# Altium schematic sheet modulo_temperaturaUmidade.SchDoc
size A4; SheetNumber: 1; SheetTotal: 1
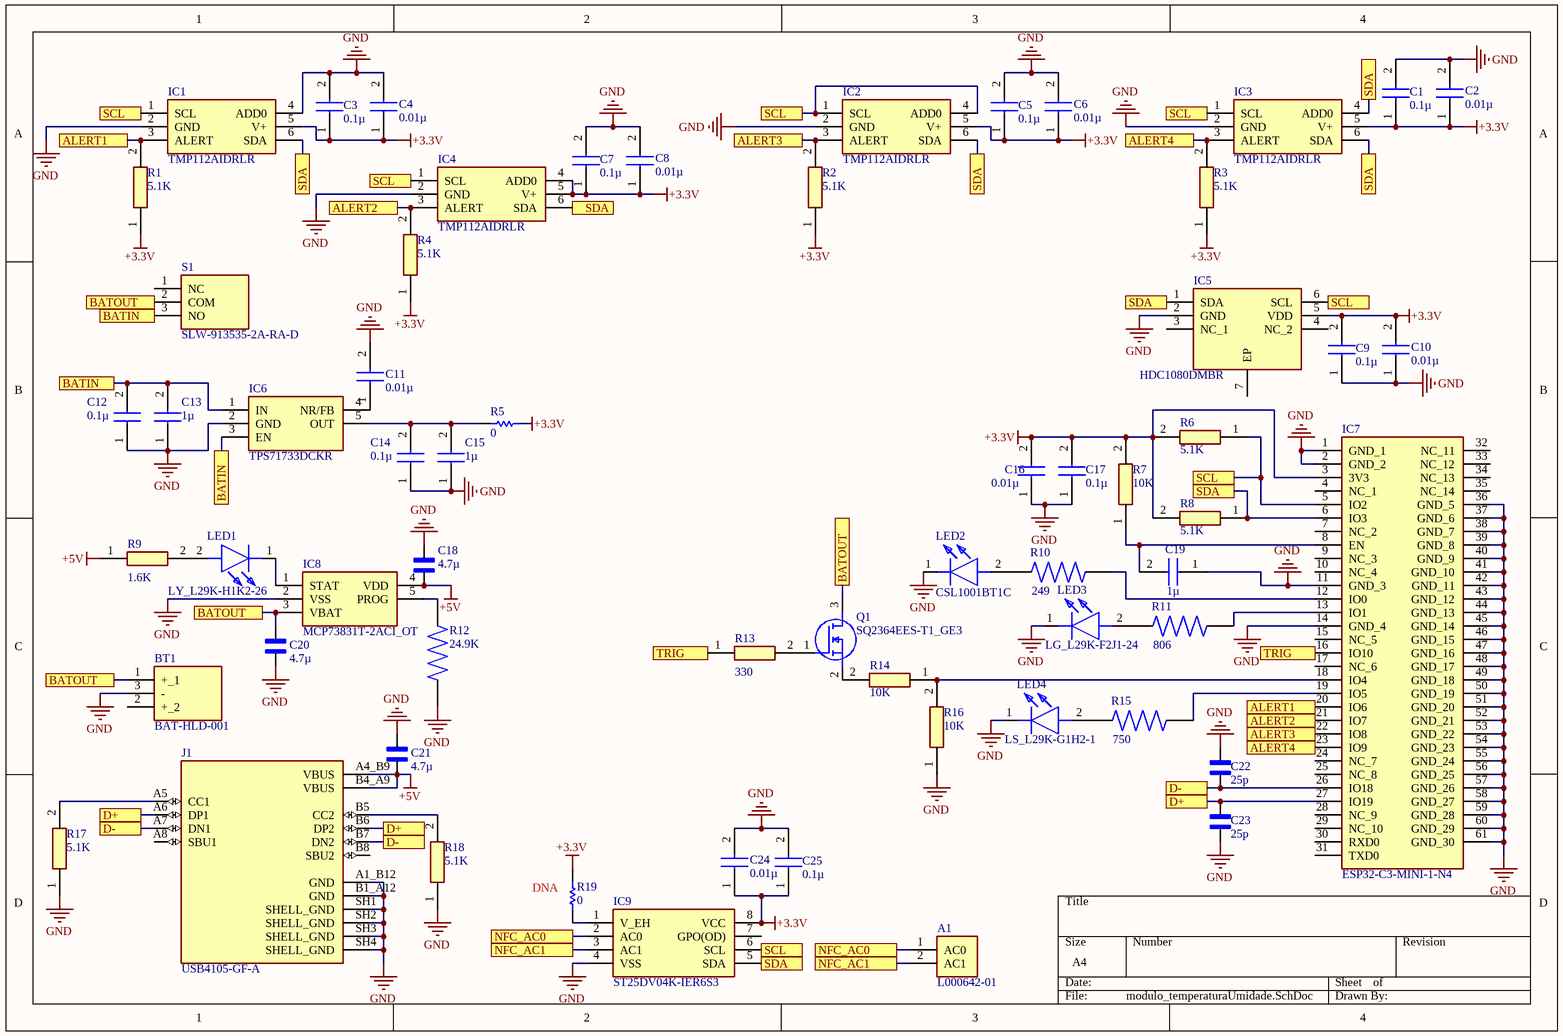
[diagram p0: modulo_temperaturaUmidade.SchDoc]

## Parts
A1  L000642-01
BT1  BAT-HLD-001  [BATHLD001]
C1  value 0.1µ  [C0603]  (hidden comment: C0603C104K4RACTU)
C2  value 0.01µ  [C0603]  (hidden comment: C0603C103K4RECTU)
C3  value 0.1µ  [C0603]  (hidden comment: C0603C104K4RACTU)
C4  value 0.01µ  [C0603]  (hidden comment: C0603C103K4RECTU)
C5  value 0.1µ  [C0603]  (hidden comment: C0603C104K4RACTU)
C6  value 0.01µ  [C0603]  (hidden comment: C0603C103K4RECTU)
C7  value 0.1µ  [C0603]  (hidden comment: C0603C104K4RACTU)
C8  value 0.01µ  [C0603]  (hidden comment: C0603C103K4RECTU)
C9  value 0.1µ  [C0603]  (hidden comment: C0603C104K4RACTU)
C10  value 0.01µ  [C0603]  (hidden comment: C0603C103K4RECTU)
C11  value 0.01µ  [C0603]  (hidden comment: C0603C103K4RECTU)
C12  value 0.1µ  [C0603]  (hidden comment: C0603C104K4RACTU)
C13  value 1µ  [CAPC1608X90N]  (hidden comment: CL10B105KO8NNNC)
C14  value 0.1µ  [C0603]  (hidden comment: C0603C104K4RACTU)
C15  value 1µ  [CAPC1608X90N]  (hidden comment: CL10B105KO8NNNC)
C16  value 0.01µ  [C0603]  (hidden comment: C0603C103K4RECTU)
C17  value 0.1µ  [C0603]  (hidden comment: C0603C104K4RACTU)
C18  value 4.7µ  [CAPC2012X140N]  (hidden comment: GRM21BR71C475KE51L)
C19  value 1µ  [CAPC1608X90N]  (hidden comment: CL10B105KO8NNNC)
C20  value 4.7µ  [CAPC2012X140N]  (hidden comment: GRM21BR71C475KE51L)
C21  value 4.7µ  [CAPC2012X140N]  (hidden comment: GRM21BR71C475KE51L)
C22  value 25p  [CAPC1608X90]  (hidden comment: CC0603JRNPO9BN250)
C23  value 25p  [CAPC1608X90]  (hidden comment: CC0603JRNPO9BN250)
C24  value 0.01µ  [C0603]  (hidden comment: C0603C103K4RECTU)
C25  value 0.1µ  [C0603]  (hidden comment: C0603C104K4RACTU)
IC1  TMP112AIDRLR  [SOTFL50P160X60-6N]
IC2  TMP112AIDRLR  [SOTFL50P160X60-6N]
IC3  TMP112AIDRLR  [SOTFL50P160X60-6N]
IC4  TMP112AIDRLR  [SOTFL50P160X60-6N]
IC5  HDC1080DMBR  [SON100P300X300X80-7N-D]
IC6  TPS71733DCKR  [SOT65P210X110-5N]
IC7  ESP32-C3-MINI-1-N4  [ESP32C3MINI1N4]
IC8  MCP73831T-2ACI_OT  [SOT95P270X145-5N]
IC9  ST25DV04K-IER6S3  [SOIC127P600X175-8N]
J1  USB4105-GF-A  [GCT_USB4105-GF-A]
LED1  LY_L29K-H1K2-26  [LYL29KH1K226]
LED2  CSL1001BT1C  [CSL1001BT1C]
LED3  LG_L29K-F2J1-24  [LEDC1308X67N]
LED4  LS_L29K-G1H2-1  [LEDC1308X67N]
Q1  SQ2364EES-T1_GE3  [SOT95P237X112-3N]
R1  value 5.1K  [RESC1608X60N]  (hidden comment: RR0816P-512-D)
R2  value 5.1K  [RESC1608X60N]  (hidden comment: RR0816P-512-D)
R3  value 5.1K  [RESC1608X60N]  (hidden comment: RR0816P-512-D)
R4  value 5.1K  [RESC1608X60N]  (hidden comment: RR0816P-512-D)
R5  value 0  (hidden comment: Resistor)
R6  value 5.1K  [RESC1608X60N]  (hidden comment: RR0816P-512-D)
R7  value 10K  [RESC1608X60N]  (hidden comment: RR0816P-103-D)
R8  value 5.1K  [RESC1608X60N]  (hidden comment: RR0816P-512-D)
R9  value 1.6K  [RESC1608X50N]  (hidden comment: RR0816P-162-D)
R10  value 249  [RESC1608X50N]  (hidden comment: RR0816P-2490-D-39A)
R11  value 806  [RESC1608X50N]  (hidden comment: RR0816P-8060-D-88A)
R12  value 24.9K  [RESC1608X50N]  (hidden comment: RR0816P-2492-D-39C)
R13  value 330  [RESC1608X60N]  (hidden comment: RR0816P-331-D)
R14  value 10K  [RESC1608X60N]  (hidden comment: RR0816P-103-D)
R15  value 750  [RESC1608X50N]  (hidden comment: RR0816P-751-D)
R16  value 10K  [RESC1608X60N]  (hidden comment: RR0816P-103-D)
R17  value 5.1K  [RESC1608X60N]  (hidden comment: RR0816P-512-D)
R18  value 5.1K  [RESC1608X60N]  (hidden comment: RR0816P-512-D)
R19  value 0  (hidden comment: Resistor)
S1  SLW-913535-2A-RA-D  [SLW9135352ARAD]

## Ports
ALERT1, ALERT2, ALERT3, ALERT4, BATIN, BATOUT, D+, D-, NFC_AC0, NFC_AC1, SCL, SDA, TRIG

## Nets
+3.3V: C1.1 C2.1 C3.1 C4.1 C5.1 C6.1 C7.1 C8.1 C9.2 C10.2 C16.2 C17.2 C24.1 C25.1 IC1.5(V+) IC2.5(V+) IC3.5(V+) IC4.4(ADD0) IC4.5(V+) IC5.5(VDD) IC7.3(3V3) IC9.8(VCC) R1.1(R1) R2.1(R1) R3.1(R1) R4.1(R1) R5.2 R6.2(R2) R7.2(R2) R8.2(R2) R19.1
+5V: C18.1 C21.1 IC8.4(VDD) J1.A4_B9(VBUS) J1.B4_A9(VBUS) R9.1
GND: BT1.3(-) C1.2 C2.2 C3.2 C4.2 C5.2 C6.2 C7.2 C8.2 C9.1 C10.1 C11.2 C12.1 C13.1 C14.1 C15.1 C16.1 C17.1 C18.2 C19.1 C20.1 C21.2 C22.1 C23.2 C24.2 C25.2 IC1.2(GND) IC1.4(ADD0) IC2.2(GND) IC3.2(GND) IC4.2(GND) IC5.2(GND) IC6.2(GND) IC7.1(GND_1) IC7.2(GND_2) IC7.11(GND_3) IC7.14(GND_4) IC7.36(GND_5) IC7.37(GND_6) IC7.38(GND_7) IC7.39(GND_8) IC7.40(GND_9) IC7.41(GND_10) IC7.42(GND_11) IC7.43(GND_12) IC7.44(GND_13) IC7.45(GND_14) IC7.46(GND_15) IC7.47(GND_16) IC7.48(GND_17) IC7.49(GND_18) IC7.50(GND_19) IC7.51(GND_20) IC7.52(GND_21) IC7.53(GND_22) IC7.54(GND_23) IC7.55(GND_24) IC7.56(GND_25) IC7.57(GND_26) IC7.58(GND_27) IC7.59(GND_28) IC7.60(GND_29) IC7.61(GND_30) IC8.2(VSS) IC9.4(VSS) J1.A1_B12(GND) J1.B1_A12(GND) J1.SH1(SHELL_GND) J1.SH2(SHELL_GND) J1.SH3(SHELL_GND) J1.SH4(SHELL_GND) LED2.1(K) LED3.1(K) LED4.1(K) R12.1 R16.1(R1) R17.1(R1) R18.1(R1)
ALERT1: IC1.3(ALERT) IC7.20(IO6) R1.2(R2) ; port ALERT1
ALERT2: IC4.3(ALERT) IC7.21(IO7) R4.2(R2) ; port ALERT2
ALERT3: IC2.3(ALERT) IC7.22(IO8) R2.2(R2) ; port ALERT3
ALERT4: IC3.3(ALERT) IC7.23(IO9) R3.2(R2) ; port ALERT4
BATIN: C12.2 C13.2 IC6.1(IN) IC6.3(EN) S1.3(NO) ; port BATIN
BATOUT: BT1.1(+_1) C20.2 IC8.3(VBAT) Q1.3(D) S1.2(COM) ; port BATOUT
D+: C23.1 IC7.27(IO19) J1.A6(DP1) J1.B6(DP2) ; port D+
D-: C22.2 IC7.26(IO18) J1.A7(DN1) J1.B7(DN2) ; port D-
NFC_AC0: A1.1(AC0) IC9.2(AC0) ; port NFC_AC0
NFC_AC1: A1.2(AC1) IC9.3(AC1) ; port NFC_AC1
SCL: IC1.1(SCL) IC2.1(SCL) IC2.4(ADD0) IC3.1(SCL) IC4.1(SCL) IC5.6(SCL) IC7.5(IO2) IC9.6(SCL) R6.1(R1) ; port SCL
SDA: IC1.6(SDA) IC2.6(SDA) IC3.4(ADD0) IC3.6(SDA) IC4.6(SDA) IC5.1(SDA) IC7.6(IO3) IC9.5(SDA) R8.1(R1) ; port SDA
TRIG: IC7.16(IO10) R13.1(R1) ; port TRIG
NetC11_1: C11.1 IC6.4(NR/FB)
NetC14_2: C14.2 C15.2 IC6.5(OUT) R5.1
NetC19_2: C19.2 IC7.8(EN) R7.1(R1)
NetIC7_12: IC7.12(IO0) R10.2
NetIC7_13: IC7.13(IO1) R11.2
NetIC7_18: IC7.18(IO4) R14.1(R1) R16.2(R2)
NetIC7_19: IC7.19(IO5) R15.2
NetIC8_1: IC8.1(STAT) LED1.1(K)
NetIC8_5: IC8.5(PROG) R12.2
NetIC9_1: IC9.1(V_EH) R19.2
NetJ1_A5: J1.A5(CC1) R17.2(R2)
NetJ1_B5: J1.B5(CC2) R18.2(R2)
NetLED1_2: LED1.2(A) R9.2
NetLED2_2: LED2.2(A) R10.1
NetLED3_2: LED3.2(A) R11.1
NetLED4_2: LED4.2(A) R15.1
NetQ1_1: Q1.1(G) R13.2(R2)
NetQ1_2: Q1.2(S) R14.2(R2)

Not connected (* = marked no-connect by the designer): BT1 2(+_2); IC5 3(NC_1) 4(NC_2) 7(EP); IC7 4(NC_1) 7(NC_2) 9(NC_3) 10(NC_4) 15(NC_5) 17(NC_6) 24(NC_7) 25(NC_8) 28(NC_9) 29(NC_10) 30(RXD0) 31(TXD0) 32(NC_11) 33(NC_12) 34(NC_13) 35(NC_14); IC9 7(GPO(OD)); J1 A8(SBU1) B8(SBU2); S1 1(NC)

## Notes on the sheet
- (near R19) DNA

## Library data of the parts
A1 = L000642-01: Antennas RFID/NFC FPC, ANT, 13.56MHZ, FERRITE, ROUND; PCBA: Assembly; MPN: L000642-01; Supplier: Mouser; Value: L000642-01
BT1 = BAT-HLD-001: Coin Cell Battery Holders Linx CR2032 Battery Holder; PCBA: Assembly; Arrow Part Number: BAT-HLD-001; MPN: BAT-HLD-001; Supplier: Mouser; Value: BAT-HLD-001
C1 C3 C5 C7 C9 C12 C14 C17 C25 = C0603C104K4RACTU: Multilayer Ceramic Capacitors MLCC - SMD/SMT 16V 0.1uF X7R 0603 10% baixa ESR; Manufacturer_Name: KEMET; PCBA: Assembly; Datasheet Link: https://content.kemet.com/datasheets/KEM_C1002_X7R_SMD.pdf; Height: 0.87mm; Manufacturer_Part_Number: C0603C104K4RACTU; Mouser Part Number: 80-C0603C104K4R; Mouser Price/Stock: https://www.mouser.co.uk/ProductDetail/KEMET/C0603C104K4RACTU?qs=l5k%252BbMnNDknCtKnMv1oEgA%3D%3D; Arrow Part Number: C0603C104K4RACTU; Arrow Price/Stock: https://www.arrow.com/en/products/c0603c104k4ractu/kemet-corporation?utm_currency=USD&region=nac; MPN: C0603C104K4RACTU; Supplier: Mouser
C2 C4 C6 C8 C10 C11 C16 C24 = C0603C103K4RECTU: Multilayer Ceramic Capacitors MLCC - SMD/SMT 16V 0.01uF X7R 0603 10% baixa ESR; Manufacturer_Name: KEMET; PCBA: Assembly; Datasheet Link: https://content.kemet.com/datasheets/KEM_C1090_X7R_ESD.pdf; Height: 0.87mm; Manufacturer_Part_Number: C0603C103K4RECTU; Mouser Part Number: 80-C0603C103K4RECTU; Mouser Price/Stock: https://www.mouser.co.uk/ProductDetail/KEMET/C0603C103K4RECTU?qs=55YtniHzbhDzGaFFpCm8vg%3D%3D; Arrow Part Number: C0603C103K4RECTU; Arrow Price/Stock: https://www.arrow.com/en/products/c0603c103k4rectu/kemet-corporation?region=nac; MPN: C0603C103K4RECTU; Supplier: Mouser
C13 C15 C19 = CL10B105KO8NNNC: Capacitor cerâmico de baixa ESR Multilayer Ceramic Capacitors MLCC - SMD/SMT 1uF+/-10% 16V X7R 16 0603; Manufacturer_Name: SAMSUNG; PCBA: Assembly; Datasheet Link: https://datasheet.datasheetarchive.com/originals/distributors/Datasheets-DGA10/2410179.pdf; Height: 0.9mm; Manufacturer_Part_Number: CL10B105KO8NNNC; Mouser Part Number: 187-CL10B105KO8NNNC; Mouser Price/Stock: https://www.mouser.co.uk/ProductDetail/Samsung-Electro-Mechanics/CL10B105KO8NNNC?qs=349EhDEZ59o2mlUAs%2FkaKg%3D%3D; Arrow Part Number: CL10B105KO8NNNC; Arrow Price/Stock: https://www.arrow.com/en/products/cl10b105ko8nnnc/samsung-electro-mechanics?utm_currency=USD&region=europe; MPN: CL10B105KO8NNNC; Supplier: Mouser
C18 C20 C21 = GRM21BR71C475KE51L: Capacitor cerâmico de baixa ESR 4.7 uF 16 VDC 10% 0805 X7R; MF: Murata Electronics; PCBA: Assembly; SnapEDA_Link: https://www.snapeda.com/parts/GRM21BR71C475KE51L/Murata/view-part/?ref=snap; Package: 2012 Murata; MP: GRM21BR71C475KE51L; Check_prices: https://www.snapeda.com/parts/GRM21BR71C475KE51L/Murata/view-part/?ref=eda; Parameter 1: *; MPN: GRM21BR71C475KE51L; Supplier: Mouser
C22 C23 = CC0603JRNPO9BN250: 25 pF Â±5% 50V Ceramic Capacitor C0G, NP0 0603 (1608 Metric) MLCC SMD/SMT; MF: Yageo; PCBA: Assembly; SnapEDA_Link: https://www.snapeda.com/parts/CC0603JRNPO9BN250/Yageo/view-part/?ref=snap; Package: 0603 Yageo; MP: CC0603JRNPO9BN250; Check_prices: https://www.snapeda.com/parts/CC0603JRNPO9BN250/Yageo/view-part/?ref=eda; MPN: CC0603JRNPO9BN250; Supplier: Mouser
IC1-IC4 = TMP112AIDRLR: Board Mount Temperature Sensors Hi-Prec Lo-Pwr Dig T emp Sensor A 595-TMP112AIDRLT; PCBA: Assembly; Arrow Part Number: TMP112AIDRLR; MPN: TMP112AIDRLR; Supplier: Mouser; Value: TMP112AIDRLR
IC5 = HDC1080DMBR: Board Mount Humidity Sensors 2% RH low-power digital relative humidit A 595-HDC1080DMBT; PCBA: Assembly; Arrow Part Number: HDC1080DMBR; MPN: HDC1080DMBR; Supplier: Mouser; Value: HDC1080DMBR
IC6 = TPS71733DCKR: LDO Voltage Regulators Sgl Output LDO 150mA Fixed(3.3V) Hi PSRR A 595-TPS71733DCKT; PCBA: Assembly; Arrow Part Number: TPS71733DCKR; MPN: TPS71733DCKR; Supplier: Mouser; Value: TPS71733DCKR
IC7 = ESP32-C3-MINI-1-N4: Multiprotocol Modules SMD module, ESP32-C3FN4, PCB antenna, -40C - +85C; PCBA: Assembly; MPN: ESP32-C3-MINI-1-N4; Supplier: Mouser; Value: ESP32-C3-MINI-1-N4
IC8 = MCP73831T-2ACI_OT: Battery Management Charge mgnt contr; MPN: MCP73831T-2ACI/OT; PCBA: Assembly; Value: MCP73831T-2ACI/OT; Arrow Part Number: MCP73831T-2ACI/OT; Supplier: Mouser
IC9 = ST25DV04K-IER6S3: NFC/RFID Tags & Transponders Dynamic NFC/RFID tag IC 4-Kbit EEPROM, and fast transfer mode capability; PCBA: Assembly; Arrow Part Number: ST25DV04K-IER6S3; MPN: ST25DV04K-IER6S3; Supplier: Mouser; Value: ST25DV04K-IER6S3
J1 = USB4105-GF-A: USB Connectors USB Type C,2.0, Rec,SMT, 0.95mmTH Shell Stakes,G/F,RA,Top Mnt,T&R; PCBA: Assembly; Value: USB4105-GF-A; MPN: USB4105-GF-A; Supplier: Mouser
LED1 = LY_L29K-H1K2-26: Single Color LEDs Smartled VIS Yellow 0603 587 nm 20 mA 2.2 V 3.6 mW; Manufacturer_Name: ams OSRAM; Manufacturer_Part_Number: LY L29K-H1K2-26; PCBA: Assembly; Value: LY L29K-H1K2-26; Datasheet Link: https://dammedia.osram.info/media/resource/hires/osram-dam-5662688/LY%20L29K_EN.pdf; Height: 0.67mm; Mouser Part Number: 720-LYL29KH1K226Z; Mouser Price/Stock: https://www.mouser.co.uk/ProductDetail/ams-OSRAM/LY-L29K-H1K2-26?qs=NTcu%252BMSV%252BkOdHd4qoSi5WQ%3D%3D; Arrow Part Number: LY L29K-H1K2-26; Arrow Price/Stock: https://www.arrow.com/en/products/ly-l29k-h1k2-26/osram-opto-semiconductors?region=nac; MPN: LY L29K-H1K2-26; Supplier: Mouser
LED2 = CSL1001BT1C: Single Color LEDs LOW CURRENT BLUE SMD LED 0603 468 nm 1 mA  2.8 V 33 mW; Manufacturer_Name: ROHM Semiconductor; PCBA: Assembly; Datasheet Link: https://fscdn.rohm.com/en/products/databook/datasheet/opto/led/chip_mono/csl1001bt1(c)-e.pdf; Height: 1.16mm; Manufacturer_Part_Number: CSL1001BT1C; Mouser Part Number: 755-CSL1001BT1C; Mouser Price/Stock: https://www.mouser.co.uk/ProductDetail/ROHM-Semiconductor/CSL1001BT1C?qs=HoCaDK9Nz5fqNTX3Pg0ReA%3D%3D; MPN: CSL1001BT1C; Supplier: Mouser; Value: CSL1001BT1C
LED3 = LG_L29K-F2J1-24: Single Color LEDs Green, 570nm 1.4-5.6mcd, 2mA 0603 2.2 V 3.4 mW; Manufacturer_Name: ams OSRAM; Manufacturer_Part_Number: LG L29K-F2J1-24; PCBA: Assembly; Value: LG L29K-F2J1-24; Datasheet Link: http://www.osram-os.com/Graphics/XPic0/00167682_0.pdf; Height: 0.67mm; Mouser Part Number: 720-LGL29KF2J124Z; Mouser Price/Stock: https://www.mouser.co.uk/ProductDetail/ams-OSRAM/LG-L29K-F2J1-24?qs=fnYUjNMxfVByrkxdJaMWtQ%3D%3D; Arrow Part Number: LG L29K-F2J1-24; Arrow Price/Stock: https://www.arrow.com/en/products/lg-l29k-f2j1-24/ams-osram?utm_currency=USD&region=europe; MPN: LG L29K-F2J1-24; Supplier: Mouser
LED4 = LS_L29K-G1H2-1: Single Color LEDs Super Red, 630nm 13mcd, 2mA 0603 2.2 V 3.6 mW; Manufacturer_Name: ams OSRAM; Manufacturer_Part_Number: LS L29K-G1H2-1; PCBA: Assembly; Value: LS L29K-G1H2-1; Datasheet Link: https://dammedia.osram.info/media/resource/hires/osram-dam-5662679/LS%20L29K_EN.pdf; Height: 0.67mm; Mouser Part Number: 720-LSL29K-G1H2-1-Z; Mouser Price/Stock: https://www.mouser.co.uk/ProductDetail/ams-OSRAM/LS-L29K-G1H2-1?qs=%252BEew9%252B0nqrDH0GMMtFi6lA%3D%3D; Arrow Part Number: LS L29K-G1H2-1; Arrow Price/Stock: https://www.arrow.com/en/products/ls-l29k-g1h2-1/osram-opto-semiconductors; MPN: LS L29K-G1H2-1; Supplier: Mouser
Q1 = SQ2364EES-T1_GE3: MOSFETs 60V Vds; +/-8V Vgs SOT-23; 4A Id; PCBA: Assembly; Arrow Part Number: SQ2364EES-T1_GE3; MPN: SQ2364EES-T1_GE3; Supplier: Mouser; Value: SQ2364EES-T1_GE3
R1-R4 R6 R8 R17 R18 = RR0816P-512-D: Thin Film Resistors - SMD 1/16W 5.1Kohm 0.5% 25ppm; Manufacturer_Name: Susumu; PCBA: Assembly; Datasheet Link: http://componentsearchengine.com/Datasheets/1/RR0816P-512-D.pdf; Manufacturer_Part_Number: RR0816P-512-D; Mouser Part Number: 754-RR0816P-512D; Mouser Price/Stock: https://www.mouser.co.uk/ProductDetail/Susumu/RR0816P-512-D?qs=nCAm%252BcMdy9ypjTUx7cPUNg%3D%3D; MPN: RR0816P-512-D; Supplier: Mouser
R7 R14 R16 = RR0816P-103-D: Thin Film Resistors - SMD 1/16W 10Kohm 0.5% 25ppm; Manufacturer_Name: Susumu; PCBA: Assembly; Datasheet Link: http://componentsearchengine.com/Datasheets/1/RR0816P-103-D.pdf; Manufacturer_Part_Number: RR0816P-103-D; Mouser Part Number: 754-RR0816P-103D; Mouser Price/Stock: https://www.mouser.co.uk/ProductDetail/Susumu/RR0816P-103-D?qs=nCAm%252BcMdy9zJFUifGf2vtQ%3D%3D; Arrow Part Number: RR0816P-103-D; Arrow Price/Stock: https://www.arrow.com/en/products/rr0816p-103-d/susumu; MPN: RR0816P-103-D; Supplier: Mouser
R9 = RR0816P-162-D: Thin Film Resistors - SMD 1/16W 1.6Kohm 0.5% 25ppm; Manufacturer_Name: Susumu; PCBA: Assembly; Datasheet Link: http://www.susumu.co.jp/common/pdf/n_catalog_partition05_en.pdf; Height: 0.5mm; Manufacturer_Part_Number: RR0816P-162-D; MPN: RR0816P-162-D; Supplier: Mouser
R10 = RR0816P-2490-D-39A: RES SMD 249 OHM 0.5% 1/16W 0603 Thin Film Resistors 25ppm; PCBA: Assembly; Package: None; Price: None; MP: RR0816P-2490-D-39A; Availability: Unavailable; MPN: RR0816P-2490-D-39A; Supplier: Mouser
R11 = RR0816P-8060-D-88A: 806 Ohms Â±0.5% 0.063W, 1/16W Chip Resistor 0603 (1608 Metric) - Thin Film SMD 25ppm; MF: Susumu; PCBA: Assembly; SnapEDA_Link: https://www.snapeda.com/parts/RR0816P-8060-D-88A/Susumu/view-part/?ref=snap; Package: 1608 Susumu; MP: RR0816P-8060-D-88A; Check_prices: https://www.snapeda.com/parts/RR0816P-8060-D-88A/Susumu/view-part/?ref=eda; MPN: RR0816P-8060-D-88A; Supplier: Mouser
R12 = RR0816P-2492-D-39C: 24.9 kOhms Â±0.5% 0.063W, 1/16W Chip Resistor 0603 (1608 Metric) - Thin Film SMD 25ppm; MF: Susumu; PCBA: Assembly; SnapEDA_Link: https://www.snapeda.com/parts/RR0816P-2492-D-39C/Susumu/view-part/?ref=snap; Package: 1608 Susumu; MP: RR0816P-2492-D-39C; Check_prices: https://www.snapeda.com/parts/RR0816P-2492-D-39C/Susumu/view-part/?ref=eda; MPN: RR0816P-2492-D-39C; Supplier: Mouser
R13 = RR0816P-331-D: Thin Film Resistors - SMD 1/16W 330ohm 0.5% 25ppm; Manufacturer_Name: Susumu; PCBA: Assembly; Manufacturer_Part_Number: RR0816P-331-D; Mouser Part Number: 754-RR0816P-331D; Mouser Price/Stock: https://www.mouser.com/Search/Refine.aspx?Keyword=754-RR0816P-331D; MPN: RR0816P-331-D; Supplier: Mouser
R15 = RR0816P-751-D: Res Thin Film 0603 750 Ohm 0.5% 0.063W(1/16W) Â±25ppm/Â°C Pad SMD Automotive T/R; MF: Susumu; PCBA: Assembly; SnapEDA_Link: https://www.snapeda.com/parts/RR0816P-751-D/Susumu/view-part/?ref=snap; Package: 1608 Susumu; MP: RR0816P-751-D; Check_prices: https://www.snapeda.com/parts/RR0816P-751-D/Susumu/view-part/?ref=eda; MPN: RR0816P-751-D; Supplier: Mouser
R19 = Resistor: PCBA: DNA; MPN: 0; Supplier: Mouser
S1 = SLW-913535-2A-RA-D: Slide Switches 9.1 x 3.5 x 3.5 mm, 2 mm Raised Slide Actuator, Right-Angle, Through Hole; PCBA: Assembly; Arrow Part Number: SLW-913535-2A-RA-D; MPN: SLW-913535-2A-RA-D; Supplier: Mouser; Value: SLW-913535-2A-RA-D
R5 = Resistor: MPN: 0